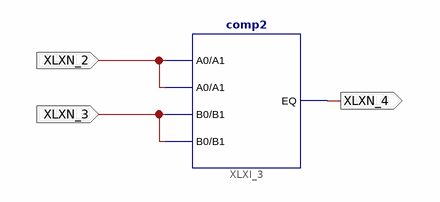
[diagram p0: schematic sheet 1]
// Xilinx ISE schematic Lab_00.sch (spartan6) as structural Verilog: 1 symbols, 3 ports
module Lab_00 (
  input  XLXN_2,
  input  XLXN_3,
  output XLXN_4
);

  comp2 XLXI_3 (.A0(XLXN_2), .A1(XLXN_2), .B0(XLXN_3), .B1(XLXN_3), .EQ(XLXN_4));
endmodule
